# Altium schematic sheet Block Diagram.SchDoc
size A4; Revision: 1; SheetNumber: 2; SheetTotal: 5
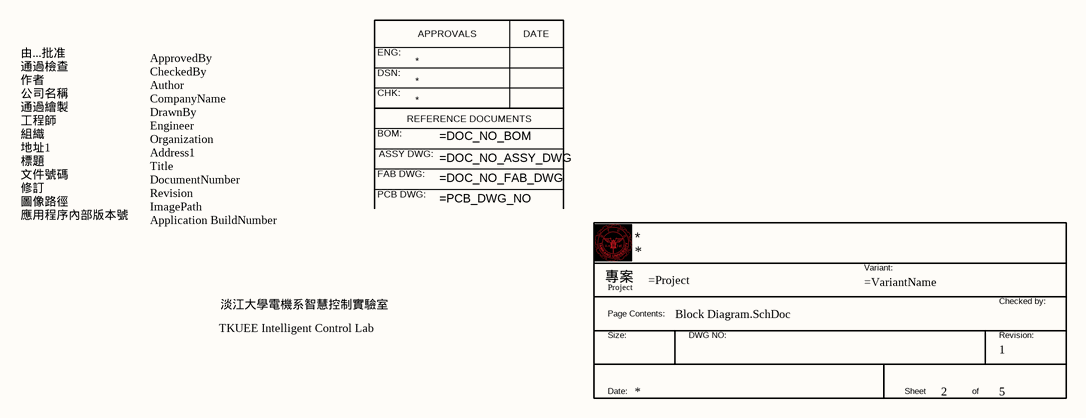
[diagram p0: Block Diagram.SchDoc]

## Parts
TitleBlock  TitleBlock  (value not drawn)

## Notes on the sheet
- (in symbol TitleBlock) APPROVALS; DATE; ENG:; DSN:; CHK:; REFERENCE DOCUMENTS; BOM:; ASSY DWG:; FAB DWG:; PCB DWG:; 由...批准 / 通過檢查 / 作者 / 公司名稱 / 通過繪製 / 工程師 / 組織 / 地址1 / 標題 / 文件號碼 / 修訂 / 圖像路徑 / 應用程序內部版本號; ApprovedBy / CheckedBy / Author / CompanyName / DrawnBy / Engineer / Organization / Address1 / Title / DocumentNumber / Revision / ImagePath / Application BuildNumber; Variant:; 專案; Project; Checked by:; 淡江大學電機系智慧控制實驗室; Page Contents:; TKUEE Intelligent Control Lab; Size:; DWG NO:; Revision:; Date:; Sheet; of